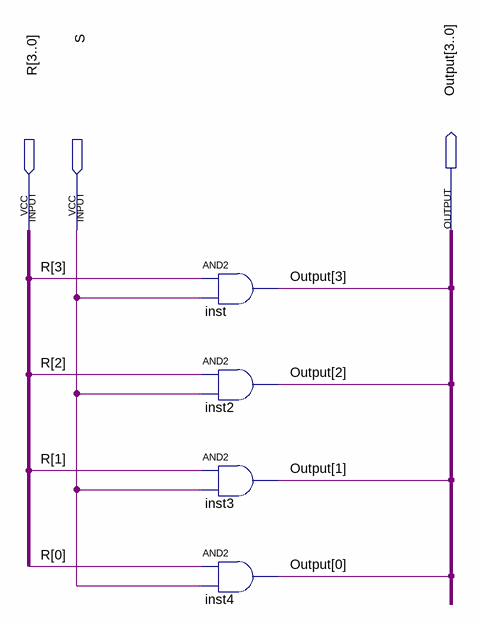
[diagram p0: schematic sheet]
// Quartus schematic AndBitVector.bdf as structural Verilog: 4 symbols, 3 pins
module AndBitVector (
  input  [3:0] R,
  input  S,
  output [3:0] Output
);

  and inst (Output[3], R[3], S);
  and inst2 (Output[2], R[2], S);
  and inst3 (Output[1], R[1], S);
  and inst4 (Output[0], R[0], S);
endmodule
